# Altium project PCB_Project2.PrjPCB
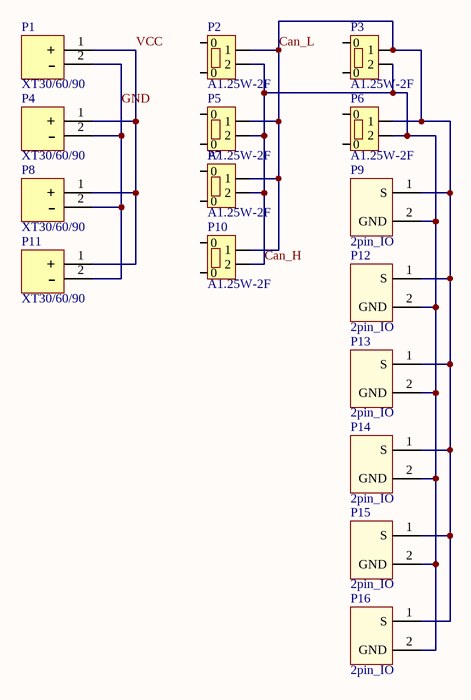
[diagram p0: Sheet2.SchDoc]
1 sheet, 16 parts. Net scope: global (net labels, ports and power ports of the same name join across sheets).
Board file: PCB1.PcbDoc

## Sheet Sheet2.SchDoc
size A4

### Parts
P1  XT30/60/90  [XT30UPB-FEMALE]
P2  A1.25W-2F  [GH1.25-2P-立贴]
P3  A1.25W-2F  [GH1.25-2P-立贴]
P4  XT30/60/90  [XT30UPB-FEMALE]
P5  A1.25W-2F  [GH1.25-2P-立贴]
P6  A1.25W-2F  [GH1.25-2P-立贴]
P7  A1.25W-2F  [GH1.25-2P-立贴]
P8  XT30/60/90  [XT30UPB-FEMALE]
P9  2pin_IO  [HY2.00MM 2X1_立式]
P10  A1.25W-2F  [GH1.25-2P-立贴]
P11  XT30/60/90  [XT30UPB-FEMALE]
P12  2pin_IO  [HY2.00MM 2X1_立式]
P13  2pin_IO  [HY2.00MM 2X1_立式]
P14  2pin_IO  [HY2.00MM 2X1_立式]
P15  2pin_IO  [HY2.00MM 2X1_立式]
P16  2pin_IO  [HY2.00MM 2X1_立式]

### Nets
Can_H: P2.2 P3.2 P5.2 P6.2 P7.2 P9.2(GND) P10.2 P12.2(GND) P13.2(GND) P14.2(GND) P15.2(GND) P16.2(GND)
Can_L: P2.1 P3.1 P5.1 P6.1 P7.1 P9.1(S) P10.1 P12.1(S) P13.1(S) P14.1(S) P15.1(S) P16.1(S)
GND: P1.2(-) P4.2(-) P8.2(-) P11.2(-)
VCC: P1.1(+) P4.1(+) P8.1(+) P11.1(+)

Not connected (* = marked no-connect by the designer): P2 0; P3 0; P5 0; P6 0; P7 0; P10 0

### Library data of the parts
P2 P3 P5-P7 P10 = GH1.25-2P